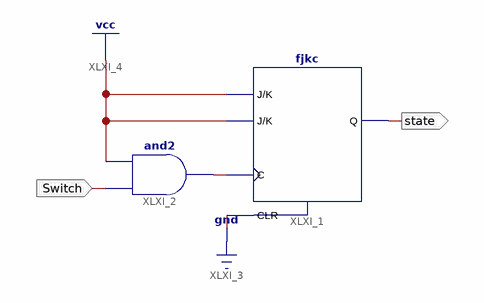
[diagram p0: schematic sheet 1]
// Xilinx ISE schematic switch.sch (spartan6) as structural Verilog: 2 symbols, 2 ports
module switch (
  input  Switch,
  output state
);

  wire XLXN_1;

  fjkc XLXI_1 (.C(XLXN_1), .CLR(1'b0), .J(1'b1), .K(1'b1), .Q(state));
  and XLXI_2 (XLXN_1, Switch, 1'b1);
endmodule
